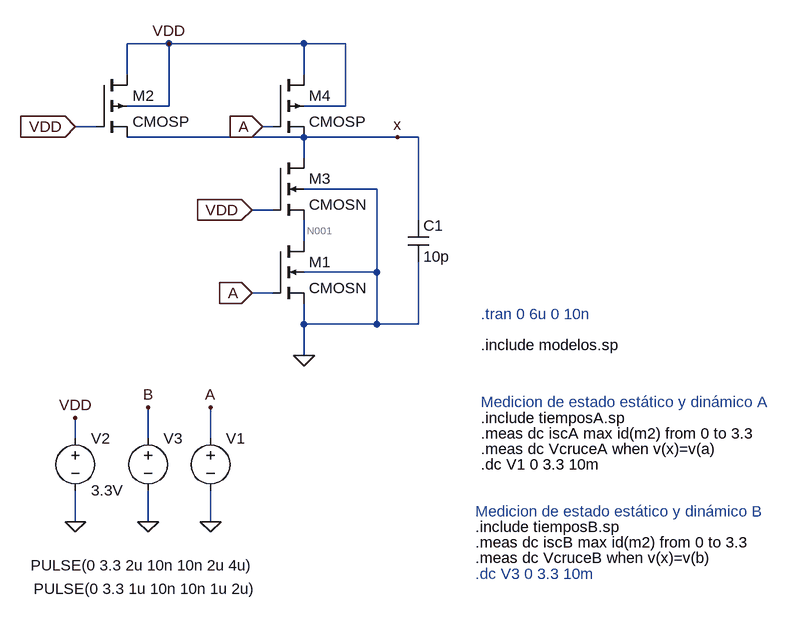
[diagram p0: schematic NAND 3mA.asc]
NAND 3mA.asc, the LTspice schematic file:
Version 4
SHEET 1 1484 824
WIRE 224 -240 160 -240
WIRE 432 -240 224 -240
WIRE 496 -240 432 -240
WIRE 160 -192 160 -240
WIRE 432 -192 432 -240
WIRE 224 -144 224 -240
WIRE 224 -144 160 -144
WIRE 496 -144 496 -240
WIRE 496 -144 432 -144
WIRE 112 -112 80 -112
WIRE 384 -112 368 -112
WIRE 432 -96 160 -96
WIRE 576 -96 432 -96
WIRE 608 -96 576 -96
WIRE 432 -64 432 -96
WIRE 544 -16 432 -16
WIRE 384 16 352 16
WIRE 608 32 608 -96
WIRE 432 64 432 32
WIRE 544 112 544 -16
WIRE 544 112 432 112
WIRE 384 144 352 144
WIRE 432 192 432 160
WIRE 544 192 544 112
WIRE 544 192 432 192
WIRE 608 192 608 96
WIRE 608 192 544 192
WIRE 432 240 432 192
WIRE 80 368 80 336
WIRE 192 368 192 320
WIRE 288 368 288 320
WIRE 80 496 80 448
WIRE 192 496 192 448
WIRE 288 496 288 448
FLAG 288 496 0
FLAG 432 240 0
FLAG 80 336 VDD
FLAG 224 -240 VDD
FLAG 288 320 A
FLAG 80 -112 VDD
IOPIN 80 -112 In
FLAG 80 496 0
FLAG 576 -96 x
FLAG 192 496 0
FLAG 192 320 B
FLAG 368 -112 A
IOPIN 368 -112 In
FLAG 352 16 VDD
IOPIN 352 16 In
FLAG 352 144 A
IOPIN 352 144 In
SYMBOL nmos4 384 64 R0
SYMATTR InstName M1
SYMATTR Value CMOSN
SYMATTR Value2 l=0.6u w=10.8u
SYMBOL pmos4 112 -192 R0
SYMATTR InstName M2
SYMATTR Value CMOSP
SYMATTR Value2 l=.6u w=32.7u
SYMBOL voltage 288 352 R0
WINDOW 3 -272 247 Left 2
WINDOW 123 0 0 Left 0
WINDOW 39 0 0 Left 0
SYMATTR Value PULSE(0 3.3 1u 10n 10n 1u 2u)
SYMATTR InstName V1
SYMBOL voltage 80 352 R0
WINDOW 123 0 0 Left 0
WINDOW 39 0 0 Left 0
SYMATTR InstName V2
SYMATTR Value 3.3V
SYMBOL cap 592 32 R0
SYMATTR InstName C1
SYMATTR Value 10p
SYMBOL nmos4 384 -64 R0
SYMATTR InstName M3
SYMATTR Value CMOSN
SYMATTR Value2 l=0.6u w=10.8u
SYMBOL pmos4 384 -192 R0
SYMATTR InstName M4
SYMATTR Value CMOSP
SYMATTR Value2 l=.6u w=32.7u
SYMBOL voltage 192 352 R0
WINDOW 3 -181 211 Left 2
WINDOW 123 0 0 Left 0
WINDOW 39 0 0 Left 0
SYMATTR Value PULSE(0 3.3 2u 10n 10n 2u 4u)
SYMATTR InstName V3
TEXT 704 224 Left 2 !.include modelos.sp
TEXT 704 176 Left 2 ;.tran 0 6u 0 10n
TEXT 704 384 Left 2 !.meas dc VcruceA when v(x)=v(a)
TEXT 704 336 Left 2 !.include tiemposA.sp
TEXT 704 360 Left 2 !.meas dc iscA max id(m2) from 0 to 3.3
TEXT 704 312 Left 2 ;Medicion de estado estático y dinámico A
TEXT 696 552 Left 2 !.meas dc VcruceB when v(x)=v(b)
TEXT 696 528 Left 2 !.meas dc iscB max id(m2) from 0 to 3.3
TEXT 696 480 Left 2 ;Medicion de estado estático y dinámico B
TEXT 696 576 Left 2 ;.dc V3 0 3.3 10m
TEXT 704 408 Left 2 !.dc V1 0 3.3 10m
TEXT 696 504 Left 2 !.include tiemposB.sp

The netlist it stands for:
* NAND 3mA.asc
M1 N001 A 0 0 CMOSN l=0.6u w=10.8u
M2 VDD VDD x VDD CMOSP l=.6u w=32.7u
V1 A 0 PULSE(0 3.3 1u 10n 10n 1u 2u)
V2 VDD 0 3.3V
C1 x 0 10p
M3 x VDD N001 0 CMOSN l=0.6u w=10.8u
M4 VDD A x VDD CMOSP l=.6u w=32.7u
V3 B 0 PULSE(0 3.3 2u 10n 10n 2u 4u)
.model NMOS NMOS
.model PMOS PMOS
.lib standard.mos
.include modelos.sp
* .tran 0 6u 0 10n
.meas dc VcruceA when v(x)=v(a)
.include tiemposA.sp
.meas dc iscA max id(m2) from 0 to 3.3
* Medicion de estado estático y dinámico A
.meas dc VcruceB when v(x)=v(b)
.meas dc iscB max id(m2) from 0 to 3.3
* Medicion de estado estático y dinámico B
* .dc V3 0 3.3 10m
.dc V1 0 3.3 10m
.include tiemposB.sp
.backanno
.end

* Results of the author's LTspice run, read from the files saved beside the schematic
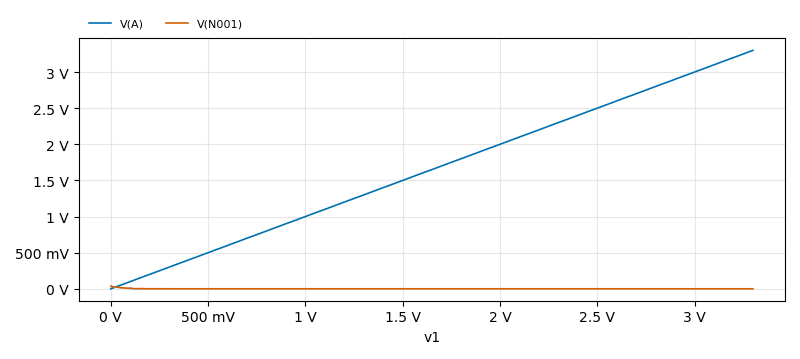
[diagram p1: DC transfer characteristic of NAND 3mA.asc, plotted from the saved traces]
* DC transfer characteristic, 1 run:
*   V(A): 0 V at v1=0 V, 3.3 V at v1=3.3 V, min 0 V, max 3.3 V
*   V(N001): 33.54 mV at v1=0 V, 867.2 pV at v1=3.3 V, min 867.2 pV, max 33.54 mV